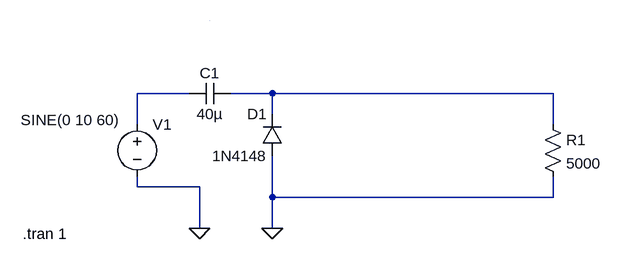
[diagram p0: schematic voltage_multiplier_t2.asc]
voltage_multiplier_t2.asc, the LTspice schematic file:
Version 4
SHEET 1 1108 680
WIRE -32 112 -112 112
WIRE 96 112 32 112
WIRE 528 112 96 112
WIRE 96 144 96 112
WIRE -112 160 -112 112
WIRE 528 160 528 112
WIRE -112 256 -112 240
WIRE -16 256 -112 256
WIRE 96 272 96 208
WIRE 528 272 528 240
WIRE 528 272 96 272
WIRE -16 320 -16 256
WIRE 96 320 96 272
WIRE 0 0 0 0
FLAG -16 320 0
FLAG 96 320 0
SYMBOL diode 112 208 R180
WINDOW 0 24 64 Left 2
WINDOW 3 24 0 Left 2
SYMATTR InstName D1
SYMATTR Value 1N4148
SYMBOL cap 32 96 R90
WINDOW 0 0 32 VBottom 2
WINDOW 3 32 32 VTop 2
SYMATTR InstName C1
SYMATTR Value 40µ
SYMBOL voltage -112 144 R0
WINDOW 3 -179 9 Left 2
WINDOW 123 0 0 Left 0
WINDOW 39 0 0 Left 0
SYMATTR Value SINE(0 10 60)
SYMATTR InstName V1
SYMBOL res 512 144 R0
SYMATTR InstName R1
SYMATTR Value 5000
TEXT -288 328 Left 2 !.tran 1

The netlist it stands for:
* voltage_multiplier_t2.asc
D1 0 N002 1N4148
C1 N002 N001 40µ
V1 N001 0 SINE(0 10 60)
R1 N002 0 5000
.model D D
.lib standard.dio
.tran 1
.backanno
.end